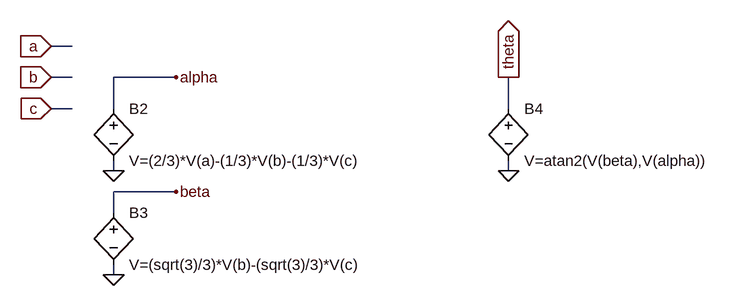
[diagram p0: schematic PLL2.asc]
PLL2.asc, the LTspice schematic file:
Version 4
SHEET 1 1128 740
WIRE 112 368 80 368
WIRE 112 416 80 416
WIRE 272 416 176 416
WIRE 112 464 80 464
WIRE 176 464 176 416
WIRE 784 464 784 416
WIRE 176 560 176 544
WIRE 784 560 784 544
WIRE 272 592 176 592
WIRE 176 624 176 592
WIRE 176 720 176 704
FLAG 80 368 a
IOPIN 80 368 In
FLAG 80 416 b
IOPIN 80 416 In
FLAG 80 464 c
IOPIN 80 464 In
FLAG 176 560 0
FLAG 176 720 0
FLAG 272 416 alpha
FLAG 272 592 beta
FLAG 784 560 0
FLAG 784 416 theta
IOPIN 784 416 Out
SYMBOL bv 176 448 R0
SYMATTR InstName B2
SYMATTR Value V=(2/3)*V(a)-(1/3)*V(b)-(1/3)*V(c)
SYMBOL bv 176 608 R0
SYMATTR InstName B3
SYMATTR Value V=(sqrt(3)/3)*V(b)-(sqrt(3)/3)*V(c)
SYMBOL bv 784 448 R0
SYMATTR InstName B4
SYMATTR Value V=atan2(V(beta),V(alpha))

The netlist it stands for:
* PLL2.asc
B2 alpha 0 V=(2/3)*V(a)-(1/3)*V(b)-(1/3)*V(c)
B3 beta 0 V=(sqrt(3)/3)*V(b)-(sqrt(3)/3)*V(c)
B4 theta 0 V=atan2(V(beta),V(alpha))
.backanno
.end